# Altium schematic sheet Sheet1.SchDoc: Наименование
size 594 x 420 mm; ApprovedBy: Утвердил; CheckedBy: Проверил; Author: Разработал; CompanyName: Организация; DrawnBy: Н.Контр; Engineer: Т.Контр; SheetNumber: 1; SheetTotal: 1; PageSetup: Record=PageOptions|CenterHorizontal=True|CenterVertical=True|PrintScale=0.94|XCorrection=1.00|YCorrection=1.00|PrintKind=1|BorderSize=5000000|LeftOffset=0|BottomOffset=0|Orientation=1|PaperLength=1000|PaperWidth=1000|Scale=100|PaperSource=7|PrintQuality=-4|MediaType=1|DitherType=10|PaperKind=A4|PrintScaleMode=1; DecimalNumber: Децимальный номер; HeadOfSector: Нач. сектора; MainDevice: Перв.примен.; Name: Наименование; DocumentName: Sheet1.SCHDOC
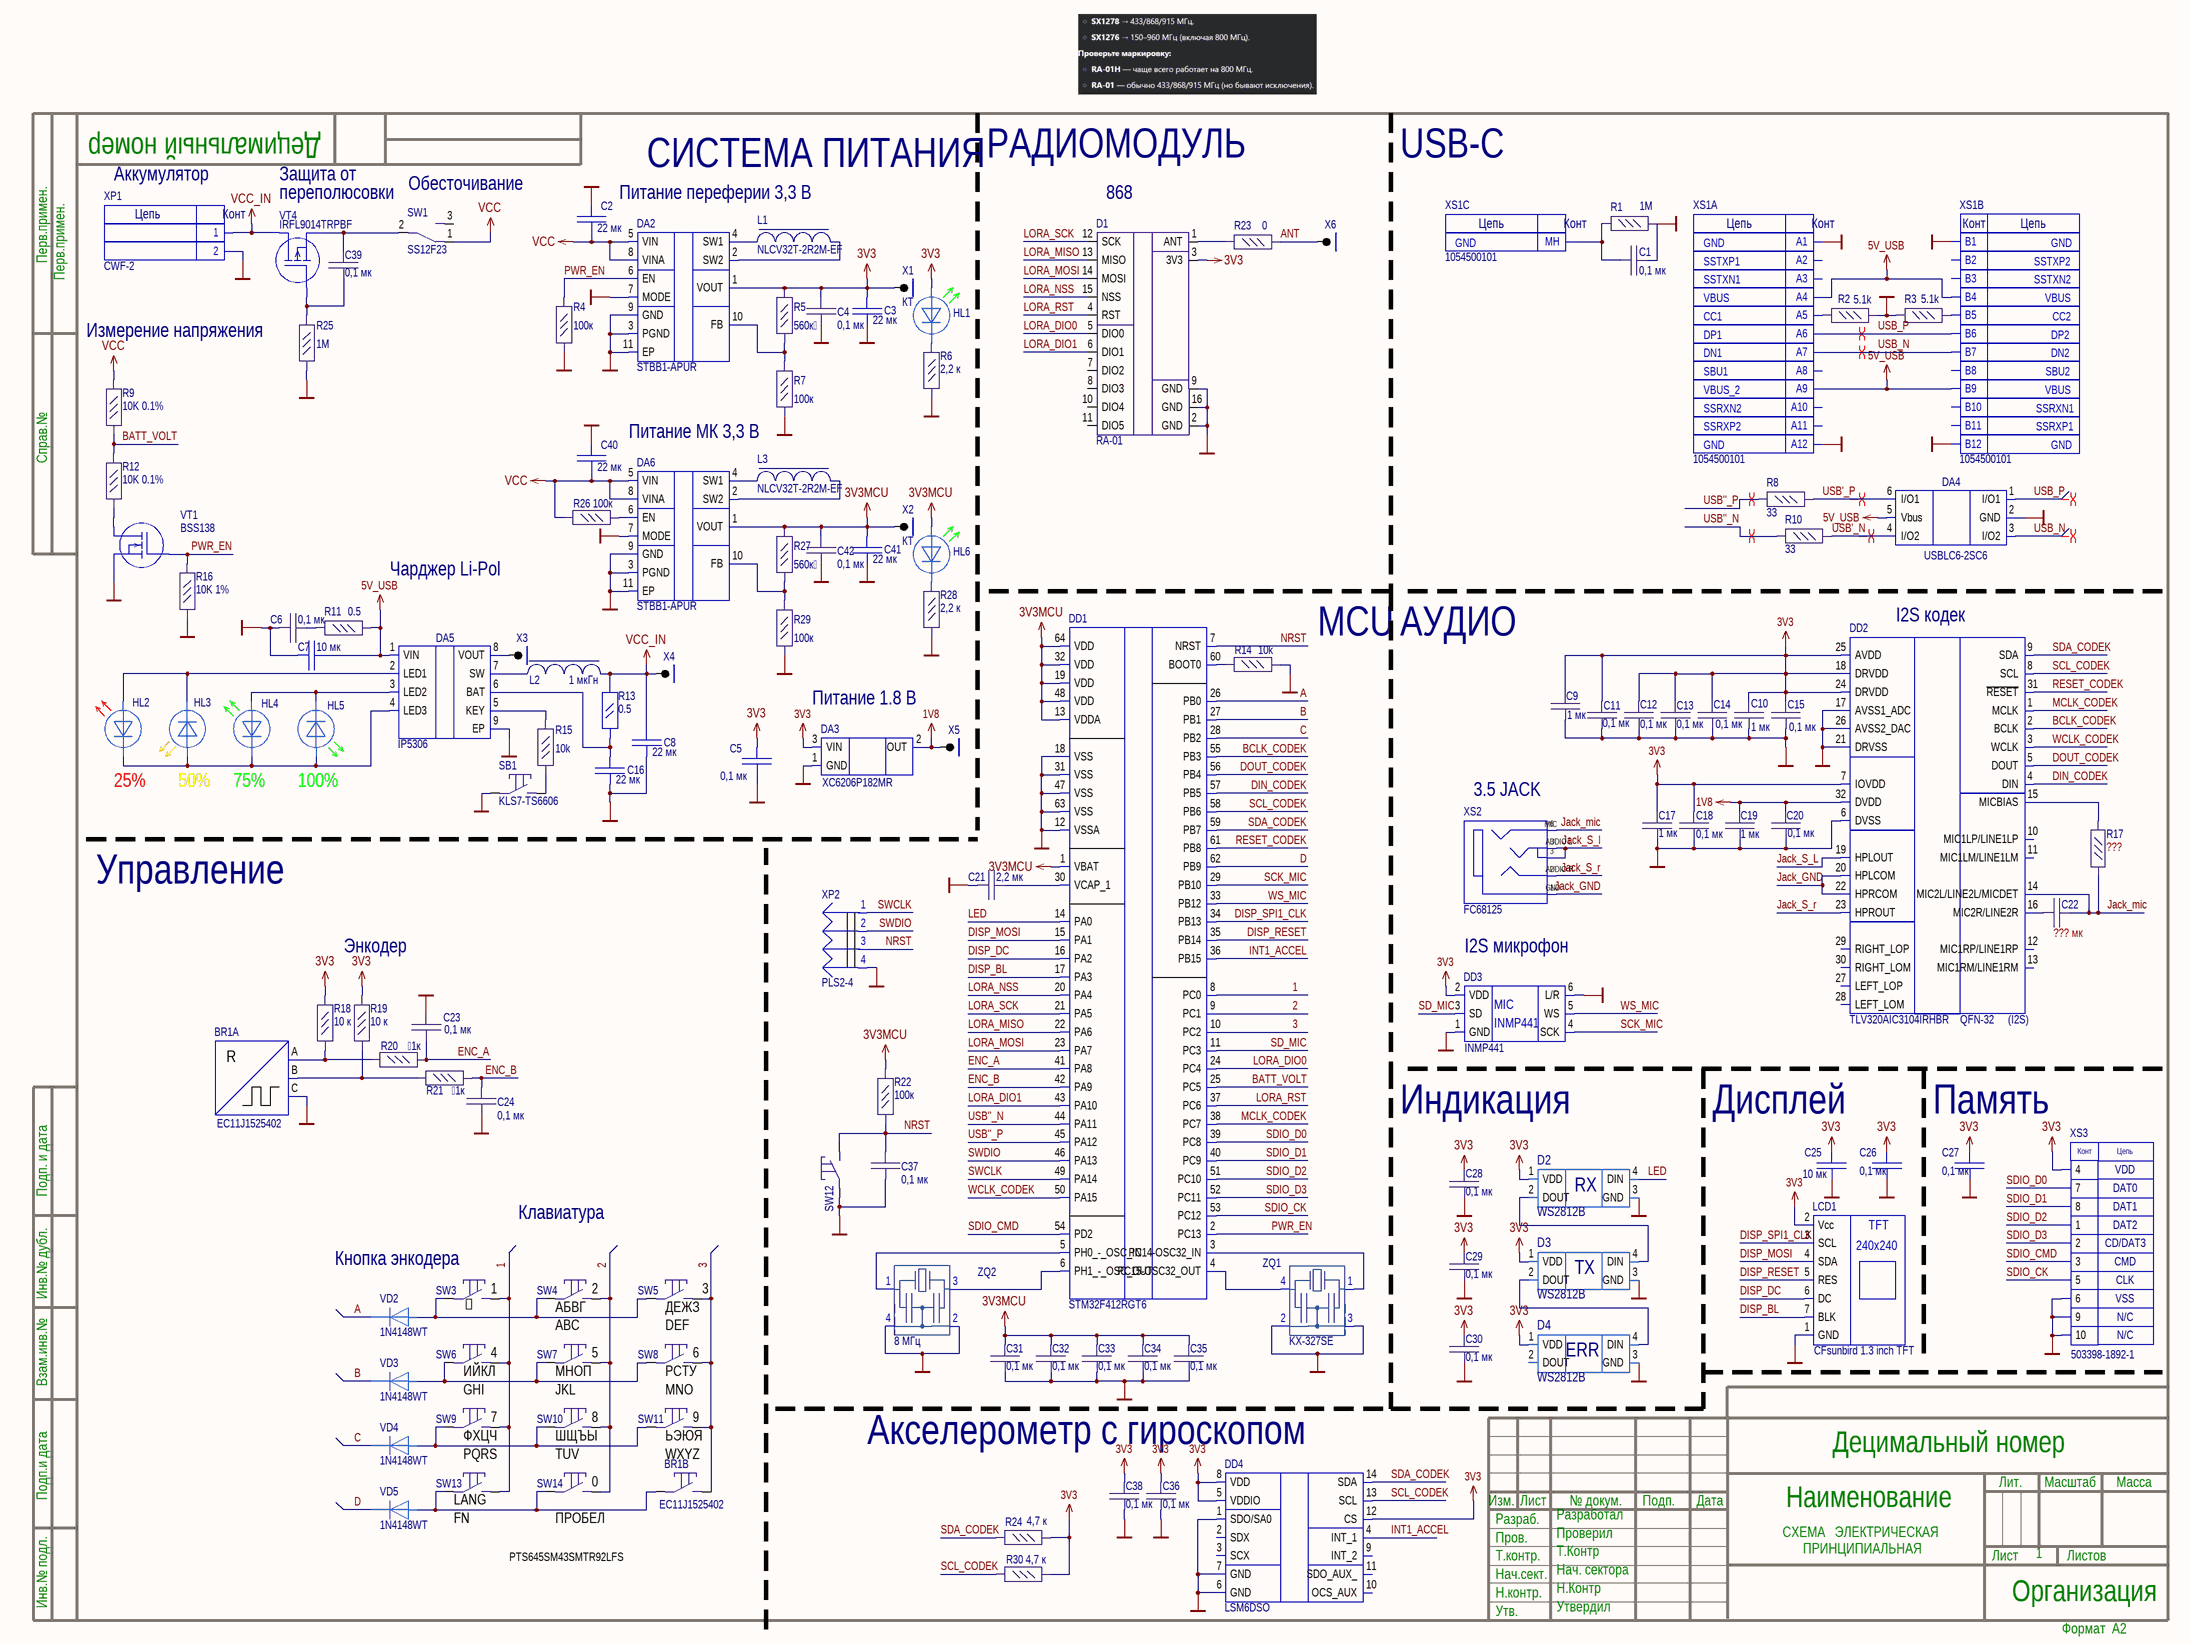
[diagram p0: Sheet1.SchDoc]

## Parts
BR1  EC11J1525402  [EC11J1525602]  (parts A,B of 2)
C1  0,1 мк  [C_0603]
C2  22 мк  [C_1210]
C3  22 мк  [C_1210]
C4  0,1 мк  [C_0603]
C5  0,1 мк  [C_0805]
C6  0,1 мк  [C_0603]
C7  10 мк  [C_1210]
C8  22 мк  [C_1210]
C9  1 мк  [C_0603]
C10  1 мк  [C_0603]
C11  0,1 мк  [C_0603]
C12  0,1 мк  [C_0603]
C13  0,1 мк  [C_0603]
C14  0,1 мк  [C_0603]
C15  0,1 мк  [C_0603]
C16  22 мк  [C_1210]
C17  1 мк  [C_0603]
C18  0,1 мк  [C_0603]
C19  1 мк  [C_0603]
C20  0,1 мк  [C_0603]
C21  2,2 мк  [C_0603]
C22  ??? мк  [C_0603]
C23  0,1 мк  [C_0603]
C24  0,1 мк  [C_0603]
C25  10 мк  [C_1210]
C26  0,1 мк  [C_0805]
C27  0,1 мк  [C_0805]
C28  0,1 мк  [C_0603]
C29  0,1 мк  [C_0603]
C30  0,1 мк  [C_0603]
C31  0,1 мк  [C_0603]
C32  0,1 мк  [C_0603]
C33  0,1 мк  [C_0603]
C34  0,1 мк  [C_0603]
C35  0,1 мк  [C_0603]
C36  0,1 мк  [C_0603]
C37  0,1 мк  [C_0603]
C38  0,1 мк  [C_0603]
C39  0,1 мк  [C_0603]
C40  22 мк  [C_1210]
C41  22 мк  [C_1210]
C42  0,1 мк  [C_0603]
D1  RA-01  [RA-02]
D2  WS2812B  [WS2812B]
D3  WS2812B  [WS2812B]
D4  WS2812B  [WS2812B]
DA2  STBB1-APUR  [DFN10]
DA3  XC6206P182MR  [SOT23]
DA4  USBLC6-2SC6  [SOT-23-6]
DA5  IP5306  [HSOIC8]
DA6  STBB1-APUR  [DFN10]
DD1  STM32F412RGT6  [LQFP64]
DD2  TLV320AIC3104IRHBR    QFN-32     (I2S)  [QFN-32]
DD3  INMP441  [INMP441]
DD4  LSM6DSO  [LGA-14]
HL1  BL-HGK36G  [LED_0603_GREEN]  (value not drawn)
HL2  BL-HJD36A-AV  [LED_0603_RED]  (value not drawn)
HL3  BL-HKC36A-AV  [LED_0603_GREEN]  (value not drawn)
HL4  BL-HGK36G  [LED_0603_GREEN]  (value not drawn)
HL5  BL-HGK36G  [LED_0603_GREEN]  (value not drawn)
HL6  BL-HGK36G  [LED_0603_GREEN]  (value not drawn)
L1  NLCV32T-2R2M-EF  [NLCV32-EF]
L2  1 мкГн  [SPM12565XT-1R0M]
L3  NLCV32T-2R2M-EF  [NLCV32-EF]
LCD1  CFsunbird 1.3 inch TFT  [OLED Display 240x240]
R1  1М  [R_0603]
R2  5.1k  [R_0603]
R3  5.1k  [R_0603]
R4  100к  [R_0603]
R5  560к  [R_0603]
R6  2,2 к  [R_0603]
R7  100к  [R_0603]
R8  33  [R_0603]
R9  10K 0.1%  [R_0603]
R10  33  [R_0603]
R11  0.5  [R_0603]
R12  10K 0.1%  [R_0603]
R13  0.5  [R_1206]
R14  10k  [R_0603]
R15  10k  [R_0603]
R16  10K 1%  [R_0603]
R17  ???  [R_0603]
R18  10 к  [R_0603]
R19  10 к  [R_0603]
R20  1к  [R_0603]
R21  1к  [R_0603]
R22  100к  [R_0603]
R23  0  [R_0603]
R24  4,7 к  [R_0603]
R25  1M  [R_0603]
R26  100к  [R_0603]
R27  560к  [R_0603]
R28  2,2 к  [R_0603]
R29  100к  [R_0603]
R30  4,7 к  [R_0603]
SB1  KLS7-TS6606  [KLS7-TS6606]
SW1  SS12F23  [SS12F23]
SW3  PTS645SM43SMTR92LFS  [KLS7-TS6604-5.0-180-B]  (value not drawn)
SW4  PTS645SM43SMTR92LFS  [KLS7-TS6604-5.0-180-B]  (value not drawn)
SW5  PTS645SM43SMTR92LFS  [KLS7-TS6604-5.0-180-B]  (value not drawn)
SW6  PTS645SM43SMTR92LFS  [KLS7-TS6604-5.0-180-B]  (value not drawn)
SW7  PTS645SM43SMTR92LFS  [KLS7-TS6604-5.0-180-B]  (value not drawn)
SW8  PTS645SM43SMTR92LFS  [KLS7-TS6604-5.0-180-B]  (value not drawn)
SW9  PTS645SM43SMTR92LFS  [KLS7-TS6604-5.0-180-B]  (value not drawn)
SW10  PTS645SM43SMTR92LFS  [KLS7-TS6604-5.0-180-B]  (value not drawn)
SW11  PTS645SM43SMTR92LFS  [KLS7-TS6604-5.0-180-B]  (value not drawn)
SW12  PTS645SM43SMTR92LFS  [KLS7-TS6604-5.0-180-B]  (value not drawn)
SW13  PTS645SM43SMTR92LFS  [KLS7-TS6604-5.0-180-B]  (value not drawn)
SW14  PTS645SM43SMTR92LFS  [KLS7-TS6604-5.0-180-B]  (value not drawn)
VD2  1N4148WT  [SOD-523F]
VD3  1N4148WT  [SOD-523F]
VD4  1N4148WT  [SOD-523F]
VD5  1N4148WT  [SOD-523F]
VT1  BSS138  [SOT23]
VT4  IRFL9014TRPBF  [SOT223]
X1  КТ  [KT_2]
X2  КТ  [KT_2]
X3  КТ  [KT_2]  (value not drawn)
X4  КТ  [KT_2]  (value not drawn)
X5  КТ  [KT_2]  (value not drawn)
X6  КТ  [KT_2]  (value not drawn)
XP1  CWF-2  [CWF-2]
XP2  PLS2-4  [PLS2-4]
XS1  1054500101  [1054500101 - 0,2]  (parts A,B,C of 3)
XS2  FC68125  [FC68125]
XS3  503398-1892-1  [503398-1892-1]
ZQ1  KX-327SЕ  [KX-327S]
ZQ2  8 МГц  [MJ CRYSTAL]

## Nets
1V8: C19.1 C20.1 DA3.2(OUT) DD2.32(DVDD) X5.1
3V3: C3.2 C4.1 C5.2 C9.1 C10.1 C11.1 C12.1 C13.1 C14.1 C15.1 C17.1 C18.1 C25.2 C26.2 C27.2 C28.2 C29.2 C30.2 C36.2 C38.2 D1.3(3V3) D2.1(VDD) D3.1(VDD) D4.1(VDD) DA2.1(VOUT) DA3.3(VIN) DD2.7(IOVDD) DD2.18(DRVDD) DD2.24(DRVDD) DD2.25(AVDD) DD3.2(VDD) DD4.5(VDDIO) DD4.8(VDD) DD4.12(CS) HL1.1 LCD1.2(Vcc) R5.2 R18.2 R19.2 R24.2 R30.2 X1.1 XS3.4
3V3MCU: C31.2 C32.2 C33.2 C34.2 C35.2 C41.2 C42.1 DA6.1(VOUT) DD1.1(VBAT) DD1.13(VDDA) DD1.19(VDD) DD1.32(VDD) DD1.48(VDD) DD1.64(VDD) HL6.1 R22.2 R27.2 X2.1
5V_USB: C7.2 DA4.5(Vbus) DA5.1(VIN) R11.2 XS1.A4 XS1.A9 XS1.B4 XS1.B9
GND: BR1.C C1.2 C2.2 C3.1 C4.2 C5.1 C6.1 C7.1 C8.1 C9.2 C10.2 C11.2 C12.2 C13.2 C14.2 C15.2 C16.1 C17.2 C18.2 C19.2 C20.2 C21.1 C23.1 C24.1 C25.1 C26.1 C27.1 C28.1 C29.1 C30.1 C31.1 C32.1 C33.1 C34.1 C35.1 C36.1 C37.1 C38.1 C40.2 C41.1 C42.2 D1.2(GND) D1.9(GND) D1.16(GND) D2.3(GND) D3.3(GND) D4.3(GND) DA2.3(PGND) DA2.7(MODE) DA2.9(GND) DA2.11(EP) DA3.1(GND) DA4.2(GND) DA5.9(EP) DA6.3(PGND) DA6.7(MODE) DA6.9(GND) DA6.11(EP) DD1.12(VSSA) DD1.18(VSS) DD1.31(VSS) DD1.47(VSS) DD1.63(VSS) DD2.6(DVSS) DD2.17(AVSS1_ADC) DD2.21(DRVSS) DD2.26(AVSS2_DAC) DD3.1(GND) DD3.6(L/R) DD4.1(SDO/SA0) DD4.6(GND) DD4.7(GND) LCD1.1(GND) R1.1 R2.1 R3.2 R4.1 R6.2 R7.1 R14.1 R16.1 R25.1 R28.2 R29.1 SB1.2 SW12.2 VT1.2(S) XP1.2 XP2.4 XS1.A1 XS1.A12 XS1.B1 XS1.B12 XS3.6 XS3.9 XS3.10 ZQ1.2 ZQ1.3 ZQ2.2 ZQ2.4
VCC: C2.1 C40.1 DA2.5(VIN) DA2.8(VINA) DA6.5(VIN) DA6.8(VINA) R9.2 R26.1 SW1.1
VCC_IN: C8.2 L2.2 R13.2 VT4.2(D) X4.1 XP1.1
1: DD1.8(PC0) SW3.1 SW6.1 SW9.1 SW13.1
2: DD1.9(PC1) SW4.1 SW7.1 SW10.1 SW14.1
3: BR1.D DD1.10(PC2) SW5.1 SW8.1 SW11.1
A: DD1.26(PB0) VD2.1
ANT: R23.2 X6.1
B: DD1.27(PB1) VD3.1
BATT_VOLT: DD1.25(PC5) R9.1 R12.2
BCLK_CODEK: DD1.55(PB3) DD2.2(BCLK)
C: DD1.28(PB2) VD4.1
D: DD1.62(PB9) VD5.1
DIN_CODEK: DD1.57(PB5) DD2.4(DIN)
DISP_BL: DD1.17(PA3) LCD1.7(BLK)
DISP_DC: DD1.16(PA2) LCD1.6(DC)
DISP_MOSI: DD1.15(PA1) LCD1.4(SDA)
DISP_RESET: DD1.35(PB14) LCD1.5(RES)
DISP_SPI1_CLK: DD1.34(PB13) LCD1.3(SCL)
DOUT_CODEK: DD1.56(PB4) DD2.5(DOUT)
ENC_A: C23.2 DD1.41(PA8) R20.1
ENC_B: C24.2 DD1.42(PA9) R21.1
INT1_ACCEL: DD1.36(PB15) DD4.4(INT_1)
Jack_GND: DD2.20(HPLCOM) DD2.22(HPRCOM) XS2.1(GND)
Jack_mic: C22.2 DD2.14(MIC2L/LINE2L/MICDET) R17.2 XS2.6(MIC)
Jack_S_L: DD2.19(HPLOUT) XS2.3(AUDIO_L)
Jack_S_r: DD2.23(HPROUT) XS2.2(AUDIO_R)
LED: D2.4(DIN) DD1.14(PA0)
LORA_DIO0: D1.5(DIO0) DD1.24(PC4)
LORA_DIO1: D1.6(DIO1) DD1.43(PA10)
LORA_MISO: D1.13(MISO) DD1.22(PA6)
LORA_MOSI: D1.14(MOSI) DD1.23(PA7)
LORA_NSS: D1.15(NSS) DD1.20(PA4)
LORA_RST: D1.4(RST) DD1.37(PC6)
LORA_SCK: D1.12(SCK) DD1.21(PA5)
MCLK_CODEK: DD1.38(PC7) DD2.1(MCLK)
NRST: C37.2 DD1.7(NRST) R22.1 SW12.1 XP2.3
PWR_EN: DA2.6(EN) DD1.2(PC13) R4.2 R16.2 VT1.1(G)
RESET_CODEK: DD1.61(PB8) DD2.31(~{RESET})
SCK_MIC: DD1.29(PB10) DD3.4(SCK)
SCL_CODEK: DD1.58(PB6) DD2.8(SCL) DD4.13(SCL) R30.1
SD_MIC: DD1.11(PC3) DD3.3(SD)
SDA_CODEK: DD1.59(PB7) DD2.9(SDA) DD4.14(SDA) R24.1
SDIO_CK: DD1.53(PC12) XS3.5
SDIO_CMD: DD1.54(PD2) XS3.3
SDIO_D0: DD1.39(PC8) XS3.7
SDIO_D1: DD1.40(PC9) XS3.8
SDIO_D2: DD1.51(PC10) XS3.1
SDIO_D3: DD1.52(PC11) XS3.2
SWCLK: DD1.49(PA14) XP2.1
SWDIO: DD1.46(PA13) XP2.2
USB''_N: DD1.44(PA11) R10.1
USB''_P: DD1.45(PA12) R8.1
USB'_N: DA4.4(I/O2) R10.2
USB'_P: DA4.6(I/O1) R8.2
USB_N: DA4.3(I/O2) XS1.A7 XS1.B7
USB_P: DA4.1(I/O1) XS1.A6 XS1.B6
WCLK_CODEK: DD1.50(PA15) DD2.3(WCLK)
WS_MIC: DD1.33(PB12) DD3.5(WS)
NetBR1_A: BR1.A R18.1 R20.2
NetBR1_B: BR1.B R19.1 R21.2
NetBR1_E: BR1.E SW13.2 SW14.2 VD5.2
NetC1_1: C1.1 R1.2 XS1.MH
NetC6_2: C6.2 R11.1
NetC16_2: C16.2 DA5.6(BAT) R13.1
NetC21_2: C21.2 DD1.30(VCAP_1)
NetC22_1: C22.1 DD2.16(MIC2R/LINE2R)
NetC39_1: C39.1 R25.2 VT4.1(G)
NetC39_2: C39.2 SW1.2 VT4.3(S)
NetD1_1: D1.1(ANT) R23.1
NetD2_2: D2.2(DOUT) D3.4(DIN)
NetD3_2: D3.2(DOUT) D4.4(DIN)
NetDA2_2: DA2.2(SW2) L1.2
NetDA2_4: DA2.4(SW1) L1.1
NetDA2_10: DA2.10(FB) R5.1 R7.2
NetDA5_2: DA5.2(LED1) HL2.1 HL3.2
NetDA5_3: DA5.3(LED2) HL4.1 HL5.2
NetDA5_4: DA5.4(LED3) HL2.2 HL3.1 HL4.2 HL5.1
NetDA5_5: DA5.5(KEY) R15.2
NetDA5_7: DA5.7(SW) L2.1
NetDA5_8: DA5.8(VOUT) X3.1
NetDA6_2: DA6.2(SW2) L3.2
NetDA6_4: DA6.4(SW1) L3.1
NetDA6_6: DA6.6(EN) R26.2
NetDA6_10: DA6.10(FB) R27.1 R29.2
NetDD1_3: DD1.3(PC14-OSC32_IN) ZQ1.1
NetDD1_4: DD1.4(PC15-OSC32_OUT) ZQ1.4
NetDD1_5: DD1.5(PH0_-_OSC_IN) ZQ2.1
NetDD1_6: DD1.6(PH1_-_OSC_OUT) ZQ2.3
NetDD1_60: DD1.60(BOOT0) R14.2
NetDD2_15: DD2.15(MICBIAS) R17.1
NetHL1_2: HL1.2 R6.1
NetHL6_2: HL6.2 R28.1
NetR2_2: R2.2 XS1.A5
NetR3_1: R3.1 XS1.B5
NetR12_1: R12.1 VT1.3(D)
NetR15_1: R15.1 SB1.1
NetSW3_2: SW3.2 SW4.2 SW5.2 VD2.2
NetSW6_2: SW6.2 SW7.2 SW8.2 VD3.2
NetSW9_2: SW9.2 SW10.2 SW11.2 VD4.2

Not connected (* = marked no-connect by the designer): D1 7(DIO2) 8(DIO3) 10(DIO4) 11(DIO5); D4 2(DOUT); DD2 10(MIC1LP/LINE1LP) 11(MIC1LM/LINE1LM) 12(MIC1RP/LINE1RP) 13(MIC1RM/LINE1RM) 27(LEFT_LOP) 28(LEFT_LOM) 29(RIGHT_LOP) 30(RIGHT_LOM); DD4 2(SDX) 3(SCX) 9(INT_2) 10(OCS_AUX) 11(SDO_AUX_); SW1 3; XS1 A2 A3 A8 A10 A11 B2 B3 B8 B10 B11

## Layout directives
differential pair: USB''_N, USB''_P, USB'_N, USB'_P, USB_N, USB_P

## Notes on the sheet
- Аккумулятор
- Защита от
- переполюсовки
- (near SW1) Обесточивание
- Питание переферии 3,3 В
- СИСТЕМА ПИТАНИЯ
- РАДИОМОДУЛЬ
- (near D1) 868
- USB-C
- (near R25) Измерение напряжения
- (near R7) Питание МК 3,3 В
- Чарджер Li-Pol
- (near DD2) I2S кодек
- MCU
- АУДИО
- Питание 1.8 В
- (near HL2) 25%
- (near HL3) 50%
- (near HL4) 75%
- (near HL5) 100%
- (near XS2) 3.5 JACK
- Управление
- Энкодер
- I2S микрофон
- Индикация
- Дисплей
- Память
- Клавиатура
- (near D2) RX
- (near SW3) Кнопка энкодера
- (near D3) TX
- (near SW3) ꝏ
- (near SW3) 1
- (near SW4) АБВГ
- (near SW4) 2
- (near SW5) ДЕЖЗ
- (near SW5) 3
- (near SW6) ИЙКЛ
- (near SW6) 4
- (near SW7) МНОП
- ABC
- (near SW7) 5
- DEF
- (near SW8) РСТУ
- (near SW8) 6
- (near D4) ERR
- GHI
- (near SW9) 7
- JKL
- (near SW10) 8
- MNO
- (near SW11) 9
- (near SW9) ФХЦЧ
- PQRS
- (near SW10) ШЩЪЫ
- TUV
- (near SW11) ЬЭЮЯ
- WXYZ
- Акселерометр с гироскопом
- (near SW13) LANG
- (near SW14) 0
- (near SW13) FN
- PTS645SM43SMTR92LFS
- (near SW14) ПРОБЕЛ
- Перв.примен.
- Справ.№
- Подп. и дата
- Инв.№ дубл.
- Взам.инв.№
- Подп.и дата
- Разраб.
- Изм.
- Лист
- № докум.
- Подп.
- Дата
- Лит.
- Масштаб
- Масса
- Т.контр.
- Пров.
- СХЕМА   ЭЛЕКТРИЧЕСКАЯ
- ПРИНЦИПИАЛЬНАЯ
- Листов
- Инв.№ подл.
- Утв.
- Н.контр.
- Нач.сект.
- Формат  A2
- (in symbol 503398-1892-1) Конт; Цепь; VDD; DAT0; DAT1; DAT2; CD/DAT3; CMD; CLK; VSS; N/C
- (in symbol 1054500101, part A) Цепь; Конт; GND; SSTXP1; SSTXN1; VBUS; CC1; DP1; DN1; SBU1; VBUS_2; SSRXN2; SSRXP2
- (in symbol 1054500101, part B) Конт; Цепь; GND; SSTXP2; SSTXN2; VBUS; CC2; DP2; DN2; SBU2; SSRXN1; SSRXP1
- (in symbol 1054500101, part C) Цепь; Конт; GND
- (in symbol CWF-2) Цепь; Конт
- (in symbol Display 240x240) TFT; 240x240
- (in symbol EC11J1525402, part A) R
- (in symbol INMP441) MIC

## Library data of the parts
BR1 = EC11J1525402: Энкодер EC11 30 щелчков, 15 импульсов, металлический вал с лыской 20мм, с кнопкой, ход кнопки 1,5мм, SMD монтаж, 100000 циклов
C1 C6 C23 C24 = GRM188R72A104MA35D: CAP CER 0.1UF 100V X7R 0603; Manufacturer: Murata Electronics; Value: 0.1µF; Part Number: GRM188R72A104MA35D; ComponentLink1URL: https://search.murata.co.jp/Ceramy/image/img/A01X/G101/ENG/GRM188R72A104MA35-01.pdf; ComponentLink1Description: Datasheet; Component Type: Capasitor
C2 C3 C7 C8 C16 C25 C40 C41 = GRM32ER71E226KE15L
C4 C9-C15 C17-C20 C22 C28-C39 C42 = GRM188R72A104KA35D: CAP CER 0.1UF 100V X7R 0603; Manufacturer: Murata Electronics; Value: 0.1µF; Part Number: GRM188R72A104KA35D; ComponentLink1URL: https://www.murata.com/~/media/webrenewal/support/library/catalog/products/capacitor/mlcc/c02e.ashx?la=en-us; ComponentLink1Description: Datasheet; Component Type: Capasitor
C5 C26 C27 = C_0805
C21 = GRM188R61H225KE11D: CAP CER 2.2UF 50V X5R 0603; Manufacturer: Murata Electronics; Value: 2.2µF; Part Number: GRM188R61H225KE11D; ComponentLink1URL: https://search.murata.co.jp/Ceramy/image/img/A01X/G101/ENG/GRM188R61H225KE11-01.pdf; ComponentLink1Description: Datasheet; Component Type: Capasitor
D1 = RA-01: LoRa modem
DA2 DA6 = STBB1-APUR: DC/DC CONV, BUCK-BOOST, 1.5MHZ, DFN-10
DA3 = XC6206P182MR: LDO стабилизатор напряжения, +1.8В, 200мА [SOT-23-3]
DA5 = IP5306: IP5306 is a multi-function power management SOC with an integrated boost converter, lithium battery charge management, and battery power indication, providing a complete power solution for mobile power supplies.
DD1 = STM32F412RGT6: ARM Cortex-M4 32b MCU+FPU
DD2 = TLV320AIC3104IRHBR: Стерео аудиокодек с программируемыми входами и выходами [VQFN-32 (5x5).]
DD3 = INMP441: Всенаправленный I2S микрофон
DD4 = LSM6DSO: Цифровой акселерометр и гироскоп [LGA-14]; Manufacturer_Name: STMicroelectronics; Datasheet Link: https://www.st.com/en/mems-and-sensors/lsm6dso.html; Height: 0.86mm; Manufacturer_Part_Number: LSM6DSO; Mouser Part Number: N/A; Mouser Price/Stock: https://www.mouser.co.uk/ProductDetail/STMicroelectronics/LSM6DSO?qs=lc2O%252BfHJPVaWmEJZZeO%252B0w%3D%3D
HL2 = BL-HJD36A-AV: SMD LED 0603 TOP красный
HL3 = BL-HKC36A-AV: SMD LED 0603 TOP желтый
L1 L3 = NLCV32T-2R2M-EF: 2.2 мкГн, 1210, 20%, Индуктивность SMD
L2 = SPM12565XT-1R0M: 1 мкГн, 42 А, 20 %
LCD1 = Display 240x240: https://aliexpress.ru/item/32858069771.html?sku_id=65356277922&spm=a2g2w.productlist.search_results.4.7a296866emIgOp
R1 = CR0603-FX-82R0ELF: RES SMD 82 OHM 1% 1/10W 0603; Manufacturer: Bourns Inc.; Value: 82; Part Number: CR0603-FX-82R0ELF; ComponentLink1URL: https://www.bourns.com/pdfs/chpreztr.pdf; ComponentLink1Description: Datasheet; Component Type: Resistor
R2 R3 = CR0603-FX-1003ELF: RES SMD 100K OHM 1% 1/10W 0603; Manufacturer: Bourns Inc.; Value: 100 кОм; Part Number: CR0603-FX-1003ELF; ComponentLink1URL: https://www.bourns.com/pdfs/chpreztr.pdf; ComponentLink1Description: Datasheet; Component Type: Resistor
R4 R7 R26 R29 = CR0603-FX-1003ELF: RES SMD 100K OHM 1% 1/10W 0603; Manufacturer: Bourns Inc.; Part Number: CR0603-FX-1003ELF; Value: 100 к; ComponentLink1URL: https://www.bourns.com/pdfs/chpreztr.pdf; ComponentLink1Description: Datasheet; Component Type: Resistor
R5 R14 R25 R27 = CR0603-FX-1003ELF: RES SMD 100K OHM 1% 1/10W 0603; Manufacturer: Bourns Inc.; Value: 100 к; Part Number: CR0603-FX-1003ELF; ComponentLink1URL: https://www.bourns.com/pdfs/chpreztr.pdf; ComponentLink1Description: Datasheet; Component Type: Resistor
R6 R28 = CR0603-FX-2201ELF: RES SMD 2.2K OHM 1% 1/10W 0603; Manufacturer: Bourns Inc.; Part Number: CR0603-FX-2201ELF; Value: 2,2 к; ComponentLink1URL: https://www.bourns.com/pdfs/chpreztr.pdf; ComponentLink1Description: Datasheet; Component Type: Resistor
R8 R10 = CR0603-FX-33R0ELF: RES SMD 33 OHM 1% 1/10W 0603; Manufacturer: Bourns Inc.; Part Number: CR0603-FX-33R0ELF; Value: 33; ComponentLink1URL: https://www.bourns.com/pdfs/chpreztr.pdf; ComponentLink1Description: Datasheet; Component Type: Resistor
R9 = CR0603-FX-1002ELF: RES SMD 100 KOHM 0.1% 1/10W 0603; Manufacturer: Bourns Inc.; Value: 10 к; Part Number: CR0603-FX-1002ELF; ComponentLink1URL: https://www.bourns.com/pdfs/chpreztr.pdf; ComponentLink1Description: Datasheet; Component Type: Resistor
R11 = CR0603-FX-1003ELF: RES SMD 0.5 OHM 1% 1/10W 0603; Manufacturer: Bourns Inc.; Value: 100 к; Part Number: CR0603-FX-1003ELF; ComponentLink1URL: https://www.bourns.com/pdfs/chpreztr.pdf; ComponentLink1Description: Datasheet; Component Type: Resistor
R12 = CR0603-FX-1002ELF: RES SMD 10 KOHM 0.1% 1/10W 0603; Manufacturer: Bourns Inc.; Value: 10 к; Part Number: CR0603-FX-1002ELF; ComponentLink1URL: https://www.bourns.com/pdfs/chpreztr.pdf; ComponentLink1Description: Datasheet; Component Type: Resistor
R13 = R_1206
R15 = CR0603-FX-1003ELF: RES SMD 10 KOHM 1% 1/10W 0603; Manufacturer: Bourns Inc.; Value: 100 к; Part Number: CR0603-FX-1003ELF; ComponentLink1URL: https://www.bourns.com/pdfs/chpreztr.pdf; ComponentLink1Description: Datasheet; Component Type: Resistor
R16 = CR0603-FX-1002ELF: RES SMD 10 KOHM 1% 1/10W 0603; Manufacturer: Bourns Inc.; Value: 10 к; Part Number: CR0603-FX-1002ELF; ComponentLink1URL: https://www.bourns.com/pdfs/chpreztr.pdf; ComponentLink1Description: Datasheet; Component Type: Resistor
R17 = CR0603-FX-1000ELF: RES SMD 100 OHM 1% 1/10W 0603; Manufacturer: Bourns Inc.; Value: 100; Part Number: CR0603-FX-1000ELF; ComponentLink1URL: https://www.bourns.com/pdfs/chpreztr.pdf; ComponentLink1Description: Datasheet; Component Type: Resistor
R18 R19 = CR0603-FX-1002ELF: RES SMD 10K OHM 1% 1/10W 0603; Manufacturer: Bourns Inc.; Part Number: CR0603-FX-1002ELF; Value: 10 к; ComponentLink1URL: https://www.bourns.com/pdfs/chpreztr.pdf; ComponentLink1Description: Datasheet; Component Type: Resistor
R20-R22 = CR0603-FX-1002ELF: RES SMD 10K OHM 1% 1/10W 0603; Manufacturer: Bourns Inc.; Value: 10 к; Part Number: CR0603-FX-1002ELF; ComponentLink1URL: https://www.bourns.com/pdfs/chpreztr.pdf; ComponentLink1Description: Datasheet; Component Type: Resistor
R23 = CR0603-FX-2201ELF: RES SMD 2.2K OHM 1% 1/10W 0603; Manufacturer: Bourns Inc.; Value: 2,2 к; Part Number: CR0603-FX-2201ELF; ComponentLink1URL: https://www.bourns.com/pdfs/chpreztr.pdf; ComponentLink1Description: Datasheet; Component Type: Resistor
R24 R30 = CR0603-FX-4701ELF: RES SMD 4.7K OHM 1% 1/10W 0603; Manufacturer: Bourns Inc.; Part Number: CR0603-FX-4701ELF; Value: 4,7 к; ComponentLink1URL: https://www.bourns.com/pdfs/chpreztr.pdf; ComponentLink1Description: Datasheet; Component Type: Resistor
SW3-SW14 = KLS7-TS6604: KLS7-TS6604 Connector, 4-Pin, Wire-to-Board, 6mm Pitch
VD2-VD5 = 1N4148WT: Диод
VT1 = BSS138: BSS138 N-Channel MOSFET, 50V, 0.2A, SOT-23
VT4 = IRFL9014TRPBF: Транзистор, P-канал 60В 1.8А [SOT-223]
XS1 = 1054500101: SB-разъем; Type C; USB 3.1; 30 В; 5 А; розетка; угловой, -30…85 °С; SMD
XS2 = FC68125: Гнездо, Jack 3,5мм, "мама", stereo
XS3 = 503398-1892-1: micro-sd card
ZQ1 = KX-327S: Кварцевый резонатор 32.768 кГц, 20 ppm
ZQ2 = MJ-8.000-12
DA4 = USBLC6-2SC6: HelpURL: https://static.chipdip.ru/lib/093/DOC001093117.pdf